# Altium schematic sheet ULN2003.SchDoc
size 297 x 209 mm; SheetNumber: 7; SheetTotal: 12
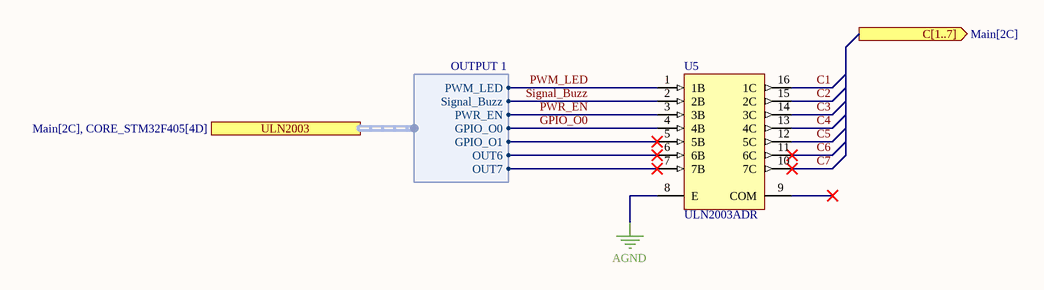
[diagram p0: ULN2003.SchDoc]

## Parts
U5  ULN2003ADR  [D0016A_M]

## Ports
C[1..7] (out, see Main[2C]), ULN2003 (harness OUTPUT 1, see Main[2C], CORE_STM32F405[4D])

## Harnesses
OUTPUT 1: PWM_LED, Signal_Buzz, OUT6, OUT7, PWR_EN, GPIO_O0, GPIO_O1

## Nets
AGND: U5.8(E)
C1: U5.16(1C)
C2: U5.15(2C)
C3: U5.14(3C)
C4: U5.13(4C)
C5: U5.12(5C)
C6: U5.11(6C)
C7: U5.10(7C)
GPIO_O0: U5.4(4B) ; port ULN2003.GPIO_O0
PWM_LED: U5.1(1B) ; port ULN2003.PWM_LED
PWR_EN: U5.3(3B) ; port ULN2003.PWR_EN
Signal_Buzz: U5.2(2B) ; port ULN2003.Signal_Buzz
NetU5_5: U5.5(5B) ; port ULN2003.GPIO_O1
NetU5_6: U5.6(6B) ; port ULN2003.OUT6
NetU5_7: U5.7(7B) ; port ULN2003.OUT7

Not connected (* = marked no-connect by the designer): U5 9(COM)*

## Notes on the sheet
- Title
- Size:
- Date:
- A4
- Variant :
- Time:
- Sheet
- Revision:
- of
- Company Link :
- Designer:
- Designer Link:
- www.fatehscan.com
- File:

## Library data of the parts
U5 = CMP-2000-04953-1: High-Voltage, High-Current Darlington Transistor Array, 0.5 A, 50 V, -20 to 70 degC, 16-Pin SOIC (D), Green (RoHS & no Sb/Br), Tape and Reel; Manufacturer: TexasInstruments; Peak DC Collector Current: 0.5A; Package Version: 4040047-6/M, 06/2011; Maximum Collector Emitter Voltage: 50V; Configuration: Array7; Maximum Collector Emitter Saturation Voltage: 1.1@100mA; Rad Hard: No; Packaging: Tape&Reel; Datasheet URL: http://www.ti.com/general/docs/lit/getliterature.tsp?genericPartNumber=uln2003a&fileType=pdf; Package Reference: D16; Category: DarlingtonBJT; Datasheet Version: Rev. O, 01/2016; Manufacturer URL: http://www.ti.com/; Type: NPN; Package Description: 16-Pin Plastic Small Outline, Body 9.9 x 3.9 mm, Pitch 1.27 mm; Mounting: SurfaceMount; Package: 16SOIC; Package URL: http://www.ti.com/lit/ml/mpds178g/mpds178g.pdf